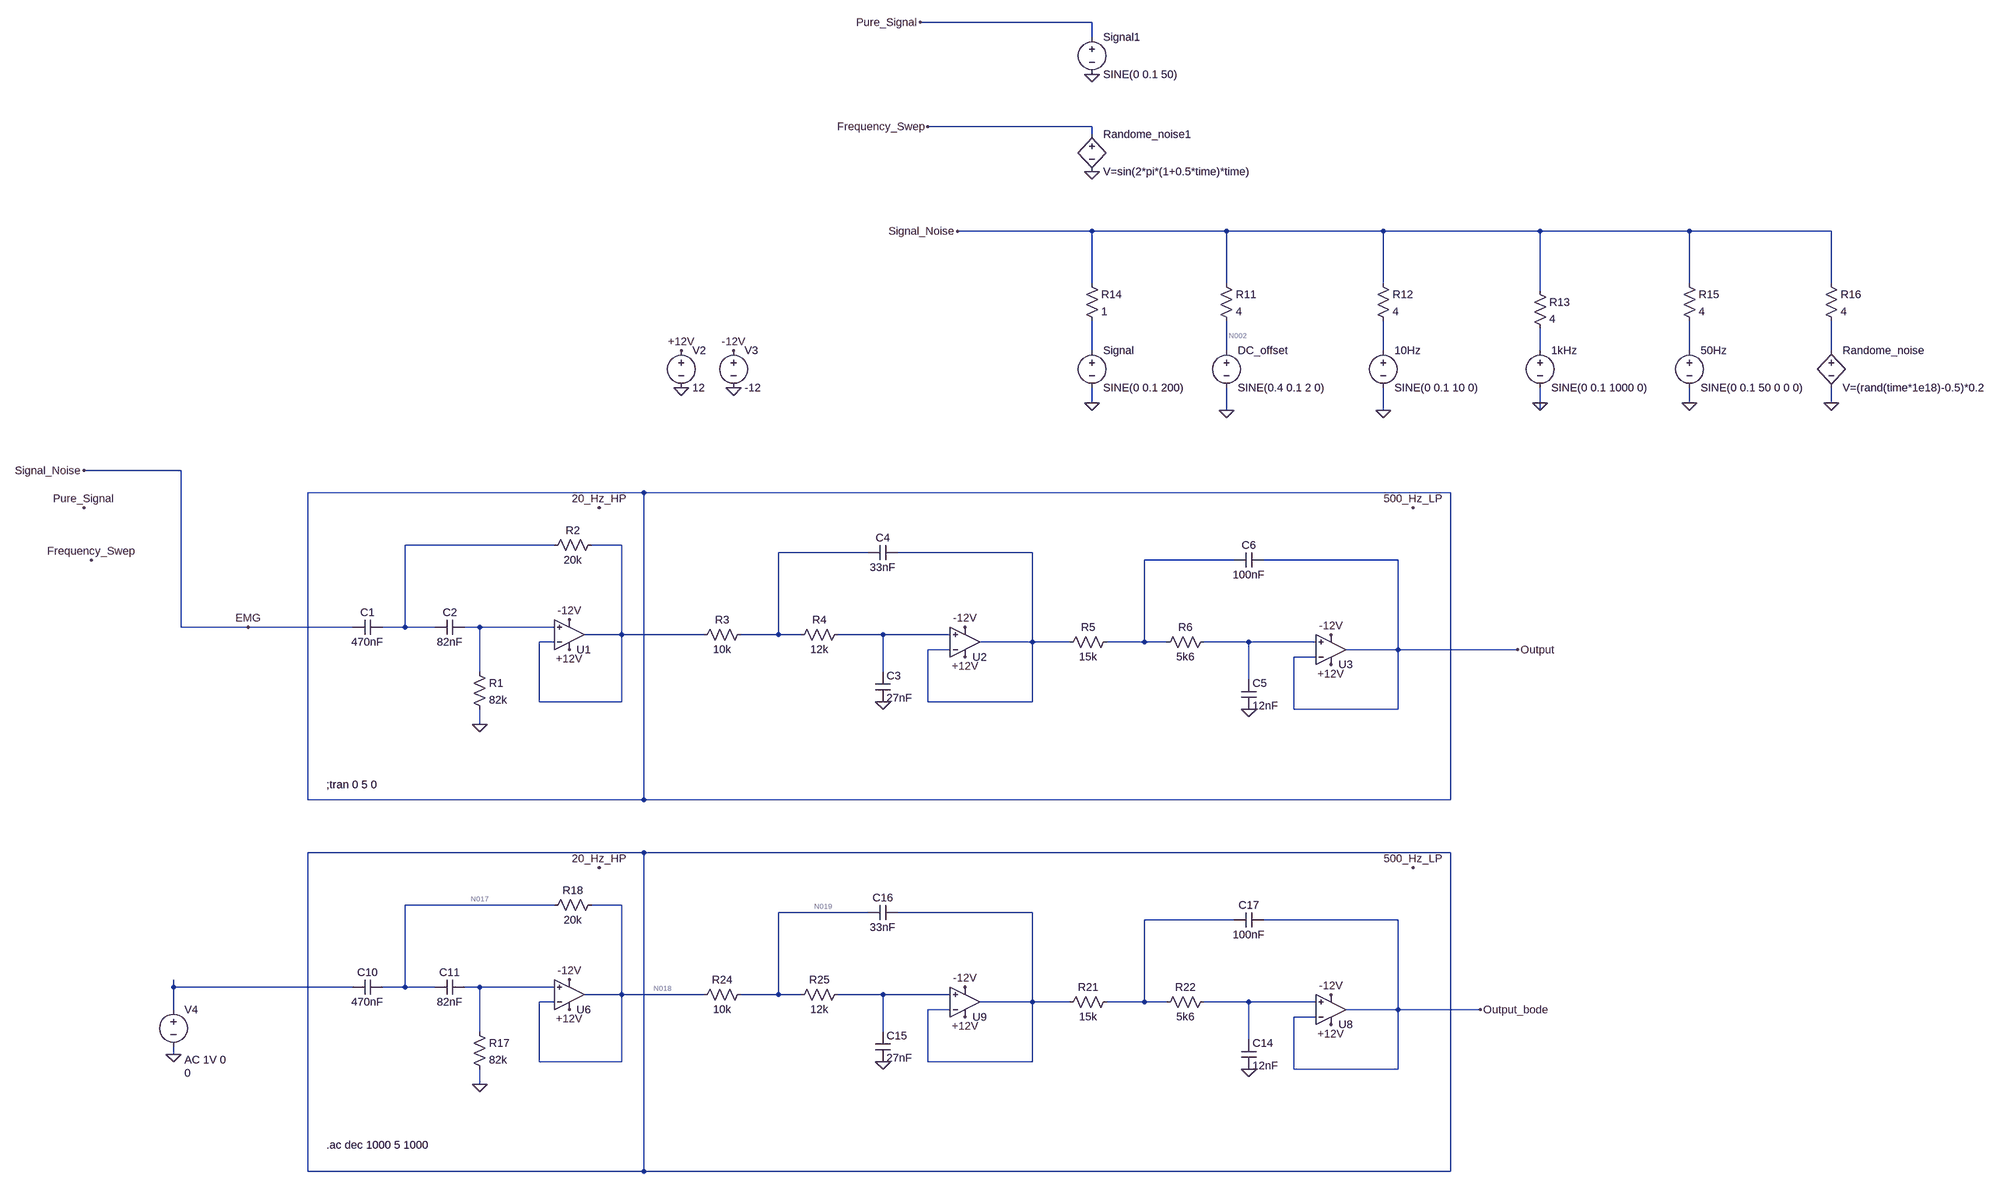
[diagram p0: schematic Analog_Filter_EMG.asc]
Analog_Filter_EMG.asc, the LTspice schematic file:
Version 4
SHEET 1 4328 1684
WIRE 1040 -1360 672 -1360
WIRE 1040 -1328 1040 -1360
WIRE 1040 -1136 688 -1136
WIRE 1040 -1120 1040 -1136
WIRE 1040 -912 752 -912
WIRE 1328 -912 1040 -912
WIRE 1664 -912 1328 -912
WIRE 2000 -912 1664 -912
WIRE 2320 -912 2000 -912
WIRE 2624 -912 2320 -912
WIRE 1040 -800 1040 -912
WIRE 1328 -800 1328 -912
WIRE 1664 -800 1664 -912
WIRE 2320 -800 2320 -912
WIRE 2624 -800 2624 -912
WIRE 2000 -784 2000 -912
WIRE 1040 -656 1040 -720
WIRE 1328 -656 1328 -720
WIRE 1664 -656 1664 -720
WIRE 2000 -656 2000 -704
WIRE 2320 -656 2320 -720
WIRE 2624 -656 2624 -720
WIRE 1040 -544 1040 -576
WIRE 2000 -544 2000 -576
WIRE 2320 -544 2320 -576
WIRE 2624 -544 2624 -576
WIRE 1328 -528 1328 -576
WIRE 1664 -528 1664 -576
WIRE 2000 -528 2000 -544
WIRE -912 -224 -1120 -224
WIRE 80 -176 -640 -176
WIRE 1808 -176 80 -176
WIRE -112 -64 -432 -64
WIRE 32 -64 -32 -64
WIRE 560 -48 368 -48
WIRE 912 -48 624 -48
WIRE 1344 -32 1152 -32
WIRE 1696 -32 1408 -32
WIRE -912 112 -912 -224
WIRE -768 112 -912 112
WIRE -544 112 -768 112
WIRE -432 112 -432 -64
WIRE -432 112 -480 112
WIRE -368 112 -432 112
WIRE -272 112 -304 112
WIRE -112 112 -272 112
WIRE 32 128 32 -64
WIRE 32 128 -48 128
WIRE 208 128 32 128
WIRE 368 128 368 -48
WIRE 368 128 288 128
WIRE 416 128 368 128
WIRE 592 128 496 128
WIRE 736 128 592 128
WIRE -112 144 -144 144
WIRE 912 144 912 -48
WIRE 912 144 800 144
WIRE 992 144 912 144
WIRE 1152 144 1152 -32
WIRE 1152 144 1072 144
WIRE 1200 144 1152 144
WIRE 1376 144 1280 144
WIRE 1520 144 1376 144
WIRE 736 160 688 160
WIRE 1696 160 1696 -32
WIRE 1696 160 1584 160
WIRE 1952 160 1696 160
WIRE 1520 176 1472 176
WIRE -272 208 -272 112
WIRE 592 208 592 128
WIRE 1376 224 1376 144
WIRE -144 272 -144 144
WIRE 32 272 32 128
WIRE 32 272 -144 272
WIRE 688 272 688 160
WIRE 912 272 912 144
WIRE 912 272 688 272
WIRE 1472 288 1472 176
WIRE 1696 288 1696 160
WIRE 1696 288 1472 288
WIRE -272 320 -272 288
WIRE -640 640 -640 -176
WIRE 80 640 80 -176
WIRE 80 640 -640 640
WIRE 1808 640 1808 -176
WIRE 1808 640 80 640
WIRE 80 784 -640 784
WIRE 1808 784 80 784
WIRE -112 896 -432 896
WIRE 32 896 -32 896
WIRE 560 912 368 912
WIRE 912 912 624 912
WIRE 1344 928 1152 928
WIRE 1696 928 1408 928
WIRE -928 1072 -928 1056
WIRE -544 1072 -928 1072
WIRE -432 1072 -432 896
WIRE -432 1072 -480 1072
WIRE -368 1072 -432 1072
WIRE -272 1072 -304 1072
WIRE -112 1072 -272 1072
WIRE 32 1088 32 896
WIRE 32 1088 -48 1088
WIRE 208 1088 32 1088
WIRE 368 1088 368 912
WIRE 368 1088 288 1088
WIRE 416 1088 368 1088
WIRE 592 1088 496 1088
WIRE 736 1088 592 1088
WIRE -112 1104 -144 1104
WIRE 912 1104 912 912
WIRE 912 1104 800 1104
WIRE 992 1104 912 1104
WIRE 1152 1104 1152 928
WIRE 1152 1104 1072 1104
WIRE 1200 1104 1152 1104
WIRE 1376 1104 1280 1104
WIRE 1520 1104 1376 1104
WIRE -928 1120 -928 1072
WIRE 736 1120 688 1120
WIRE 1696 1120 1696 928
WIRE 1696 1120 1584 1120
WIRE 1872 1120 1696 1120
WIRE 1520 1136 1472 1136
WIRE -272 1168 -272 1072
WIRE 592 1168 592 1088
WIRE 1376 1184 1376 1104
WIRE -928 1216 -928 1200
WIRE -144 1232 -144 1104
WIRE 32 1232 32 1088
WIRE 32 1232 -144 1232
WIRE 688 1232 688 1120
WIRE 912 1232 912 1104
WIRE 912 1232 688 1232
WIRE 1472 1248 1472 1136
WIRE 1696 1248 1696 1120
WIRE 1696 1248 1472 1248
WIRE -272 1280 -272 1248
WIRE -640 1600 -640 784
WIRE 80 1600 80 784
WIRE 80 1600 -640 1600
WIRE 1808 1600 1808 784
WIRE 1808 1600 80 1600
FLAG 272 -576 0
FLAG 160 -576 0
FLAG 160 -656 +12V
FLAG 272 -656 -12V
FLAG 1328 -528 0
FLAG 1664 -528 0
FLAG 2000 -544 0
FLAG 1040 -544 0
FLAG 752 -912 Signal_Noise
FLAG -1120 -224 Signal_Noise
FLAG 2320 -544 0
FLAG 2624 -544 0
FLAG 1952 160 Output
FLAG -272 1280 0
FLAG -80 1056 -12V
FLAG -80 1120 +12V
FLAG 592 1232 0
FLAG 768 1072 -12V
FLAG 768 1136 +12V
FLAG -16 816 20_Hz_HP
FLAG 1728 816 500_Hz_LP
FLAG 1872 1120 Output_bode
FLAG -928 1216 0
FLAG 1040 -1040 0
FLAG 688 -1136 Frequency_Swep
FLAG -1104 -32 Frequency_Swep
FLAG 1040 -1248 0
FLAG 672 -1360 Pure_Signal
FLAG -1120 -144 Pure_Signal
FLAG 1376 1248 0
FLAG 1552 1088 -12V
FLAG 1552 1152 +12V
FLAG -272 320 0
FLAG -80 96 -12V
FLAG -80 160 +12V
FLAG 592 272 0
FLAG 768 112 -12V
FLAG 768 176 +12V
FLAG -16 -144 20_Hz_HP
FLAG 1728 -144 500_Hz_LP
FLAG 1376 288 0
FLAG 1552 128 -12V
FLAG 1552 192 +12V
FLAG -768 112 EMG
SYMBOL voltage 1664 -672 R0
WINDOW 123 0 0 Left 0
WINDOW 39 0 0 Left 0
SYMATTR InstName 10Hz
SYMATTR Value SINE(0 0.1 10 0)
SYMBOL voltage 160 -672 R0
WINDOW 123 0 0 Left 0
WINDOW 39 0 0 Left 0
SYMATTR InstName V2
SYMATTR Value 12
SYMBOL voltage 272 -672 R0
WINDOW 123 0 0 Left 0
WINDOW 39 0 0 Left 0
SYMATTR InstName V3
SYMATTR Value -12
SYMBOL voltage 2000 -672 R0
WINDOW 123 0 0 Left 0
WINDOW 39 0 0 Left 0
SYMATTR InstName 1kHz
SYMATTR Value SINE(0 0.1 1000 0)
SYMBOL voltage 1328 -672 R0
WINDOW 123 0 0 Left 0
WINDOW 39 0 0 Left 0
SYMATTR InstName DC_offset
SYMATTR Value SINE(0.4 0.1 2 0)
SYMBOL res 1312 -816 R0
SYMATTR InstName R11
SYMATTR Value 4
SYMBOL res 1648 -816 R0
SYMATTR InstName R12
SYMATTR Value 4
SYMBOL res 1984 -800 R0
SYMATTR InstName R13
SYMATTR Value 4
SYMBOL voltage 1040 -672 R0
WINDOW 123 0 0 Left 0
WINDOW 39 0 0 Left 0
SYMATTR InstName Signal
SYMATTR Value SINE(0 0.1 200)
SYMBOL res 1024 -816 R0
SYMATTR InstName R14
SYMATTR Value 1
SYMBOL voltage 2320 -672 R0
WINDOW 123 0 0 Left 0
WINDOW 39 0 0 Left 0
SYMATTR InstName 50Hz
SYMATTR Value SINE(0 0.1 50 0 0 0)
SYMBOL res 2304 -816 R0
SYMATTR InstName R15
SYMATTR Value 4
SYMBOL bv 2624 -672 R0
SYMATTR InstName Randome_noise
SYMATTR Value V=(rand(time*1e18)-0.5)*0.2
SYMBOL res 2608 -816 R0
SYMATTR InstName R16
SYMATTR Value 4
SYMBOL cap -480 1056 R90
WINDOW 0 0 32 VBottom 2
WINDOW 3 32 32 VTop 2
SYMATTR InstName C10
SYMATTR Value 470nF
SYMBOL cap -304 1056 R90
WINDOW 0 0 32 VBottom 2
WINDOW 3 32 32 VTop 2
SYMATTR InstName C11
SYMATTR Value 82nF
SYMBOL res -288 1152 R0
SYMATTR InstName R17
SYMATTR Value 82k
SYMBOL res -16 880 R90
WINDOW 0 0 56 VBottom 2
WINDOW 3 32 56 VTop 2
SYMATTR InstName R18
SYMATTR Value 20k
SYMBOL Opamps\\UniversalOpamp2 -80 1088 M180
SYMATTR InstName U6
SYMBOL res 304 1072 R90
WINDOW 0 0 56 VBottom 2
WINDOW 3 32 56 VTop 2
SYMATTR InstName R24
SYMATTR Value 10k
SYMBOL res 512 1072 R90
WINDOW 0 0 56 VBottom 2
WINDOW 3 32 56 VTop 2
SYMATTR InstName R25
SYMATTR Value 12k
SYMBOL cap 576 1168 R0
SYMATTR InstName C15
SYMATTR Value 27nF
SYMBOL cap 624 896 R90
WINDOW 0 0 32 VBottom 2
WINDOW 3 32 32 VTop 2
SYMATTR InstName C16
SYMATTR Value 33nF
SYMBOL Opamps\\UniversalOpamp2 768 1104 M180
SYMATTR InstName U9
SYMBOL voltage -928 1104 R0
WINDOW 3 24 152 Left 2
WINDOW 123 24 124 Left 2
WINDOW 39 0 0 Left 0
SYMATTR Value 0
SYMATTR Value2 AC 1V 0
SYMATTR InstName V4
SYMBOL bv 1040 -1136 R0
SYMATTR InstName Randome_noise1
SYMATTR Value V=sin(2*pi*(1+0.5*time)*time)
SYMBOL voltage 1040 -1344 R0
WINDOW 123 0 0 Left 0
WINDOW 39 0 0 Left 0
SYMATTR InstName Signal1
SYMATTR Value SINE(0 0.1 50)
SYMBOL res 1088 1088 R90
WINDOW 0 0 56 VBottom 2
WINDOW 3 32 56 VTop 2
SYMATTR InstName R21
SYMATTR Value 15k
SYMBOL res 1296 1088 R90
WINDOW 0 0 56 VBottom 2
WINDOW 3 32 56 VTop 2
SYMATTR InstName R22
SYMATTR Value 5k6
SYMBOL cap 1360 1184 R0
SYMATTR InstName C14
SYMATTR Value 12nF
SYMBOL cap 1408 912 R90
WINDOW 0 0 32 VBottom 2
WINDOW 3 32 32 VTop 2
SYMATTR InstName C17
SYMATTR Value 100nF
SYMBOL Opamps\\UniversalOpamp2 1552 1120 M180
SYMATTR InstName U8
SYMBOL cap -480 96 R90
WINDOW 0 0 32 VBottom 2
WINDOW 3 32 32 VTop 2
SYMATTR InstName C1
SYMATTR Value 470nF
SYMBOL cap -304 96 R90
WINDOW 0 0 32 VBottom 2
WINDOW 3 32 32 VTop 2
SYMATTR InstName C2
SYMATTR Value 82nF
SYMBOL res -288 192 R0
SYMATTR InstName R1
SYMATTR Value 82k
SYMBOL res -16 -80 R90
WINDOW 0 0 56 VBottom 2
WINDOW 3 32 56 VTop 2
SYMATTR InstName R2
SYMATTR Value 20k
SYMBOL Opamps\\UniversalOpamp2 -80 128 M180
SYMATTR InstName U1
SYMBOL res 304 112 R90
WINDOW 0 0 56 VBottom 2
WINDOW 3 32 56 VTop 2
SYMATTR InstName R3
SYMATTR Value 10k
SYMBOL res 512 112 R90
WINDOW 0 0 56 VBottom 2
WINDOW 3 32 56 VTop 2
SYMATTR InstName R4
SYMATTR Value 12k
SYMBOL cap 576 208 R0
SYMATTR InstName C3
SYMATTR Value 27nF
SYMBOL cap 624 -64 R90
WINDOW 0 0 32 VBottom 2
WINDOW 3 32 32 VTop 2
SYMATTR InstName C4
SYMATTR Value 33nF
SYMBOL Opamps\\UniversalOpamp2 768 144 M180
SYMATTR InstName U2
SYMBOL res 1088 128 R90
WINDOW 0 0 56 VBottom 2
WINDOW 3 32 56 VTop 2
SYMATTR InstName R5
SYMATTR Value 15k
SYMBOL res 1296 128 R90
WINDOW 0 0 56 VBottom 2
WINDOW 3 32 56 VTop 2
SYMATTR InstName R6
SYMATTR Value 5k6
SYMBOL cap 1360 224 R0
SYMATTR InstName C5
SYMATTR Value 12nF
SYMBOL cap 1408 -48 R90
WINDOW 0 0 32 VBottom 2
WINDOW 3 32 32 VTop 2
SYMATTR InstName C6
SYMATTR Value 100nF
SYMBOL Opamps\\UniversalOpamp2 1552 160 M180
SYMATTR InstName U3
TEXT -600 1544 Left 2 !.ac dec 1000 5 1000
TEXT -600 608 Left 2 !;tran 0 5 0

The netlist it stands for:
* Analog_Filter_EMG.asc
V§10Hz N003 0 SINE(0 0.1 10 0)
V2 +12V 0 12
V3 -12V 0 -12
V§1kHz N004 0 SINE(0 0.1 1000 0)
V§DC_offset N002 0 SINE(0.4 0.1 2 0)
R11 EMG N002 4
R12 EMG N003 4
R13 EMG N004 4
V§Signal N001 0 SINE(0 0.1 200)
R14 EMG N001 1
V§50Hz N005 0 SINE(0 0.1 50 0 0 0)
R15 EMG N005 4
B§Randome_noise N006 0 V=(rand(time*1e18)-0.5)*0.2
R16 EMG N006 4
C10 N017 N022 470nF
C11 N023 N017 82nF
R17 N023 0 82k
R18 N018 N017 20k
XU6 N023 N018 +12V -12V N018 level.2 Avol=1Meg GBW=10Meg Slew=10Meg ilimit=25m rail=0 Vos=0 phimargin=45 en=0 enk=0 in=0 ink=0 Rin=500Meg  ; pins IN+ IN- V+ V- OUT
R24 N019 N018 10k
R25 N024 N019 12k
C15 N024 0 27nF
C16 N020 N019 33nF
XU9 N024 N020 +12V -12V N020 level.2 Avol=1Meg GBW=10Meg Slew=10Meg ilimit=25m rail=0 Vos=0 phimargin=45 en=0 enk=0 in=0 ink=0 Rin=500Meg  ; pins IN+ IN- V+ V- OUT
V4 N022 0 0 AC 1V 0
B§Randome_noise1 Frequency_Swep 0 V=sin(2*pi*(1+0.5*time)*time)
V§Signal1 Pure_Signal 0 SINE(0 0.1 50)
R21 N021 N020 15k
R22 N025 N021 5k6
C14 N025 0 12nF
C17 Output_bode N021 100nF
XU8 N025 Output_bode +12V -12V Output_bode level.2 Avol=1Meg GBW=10Meg Slew=10Meg ilimit=25m rail=0 Vos=0 phimargin=45 en=0 enk=0 in=0 ink=0 Rin=500Meg  ; pins IN+ IN- V+ V- OUT
C1 N008 EMG 470nF
C2 N013 N008 82nF
R1 N013 0 82k
R2 N009 N008 20k
XU1 N013 N009 +12V -12V N009 level.2 Avol=1Meg GBW=10Meg Slew=10Meg ilimit=25m rail=0 Vos=0 phimargin=45 en=0 enk=0 in=0 ink=0 Rin=500Meg  ; pins IN+ IN- V+ V- OUT
R3 N010 N009 10k
R4 N014 N010 12k
C3 N014 0 27nF
C4 N011 N010 33nF
XU2 N014 N011 +12V -12V N011 level.2 Avol=1Meg GBW=10Meg Slew=10Meg ilimit=25m rail=0 Vos=0 phimargin=45 en=0 enk=0 in=0 ink=0 Rin=500Meg  ; pins IN+ IN- V+ V- OUT
R5 N012 N011 15k
R6 N015 N012 5k6
C5 N015 0 12nF
C6 Output N012 100nF
XU3 N015 Output +12V -12V Output level.2 Avol=1Meg GBW=10Meg Slew=10Meg ilimit=25m rail=0 Vos=0 phimargin=45 en=0 enk=0 in=0 ink=0 Rin=500Meg  ; pins IN+ IN- V+ V- OUT
.ac dec 1000 5 1000
;tran 0 5 0
.lib UniversalOpamps2.sub
.backanno
.end

* Results of the author's LTspice run, read from the files saved beside the schematic
* Operating Point, zero values left out:
*   V(+12v) = 12 V
*   V(-12v) = -12 V
*   V(n002) = 400 mV
*   V(emg) = 44.44 mV
*   I(Randome_noise) = 11.11 mA
*   I(R16) = 11.11 mA
*   I(R15) = 11.11 mA
*   I(R14) = 44.44 mA
*   I(R13) = 11.11 mA
*   I(R12) = 11.11 mA
*   I(R11) = -88.89 mA
*   I(50hz) = 11.11 mA
*   I(Signal) = 44.44 mA
*   I(Dc_offset) = -88.89 mA
*   I(1khz) = 11.11 mA
*   I(V3) = 7.195 mA
*   I(V2) = -7.195 mA
*   I(10hz) = 11.11 mA
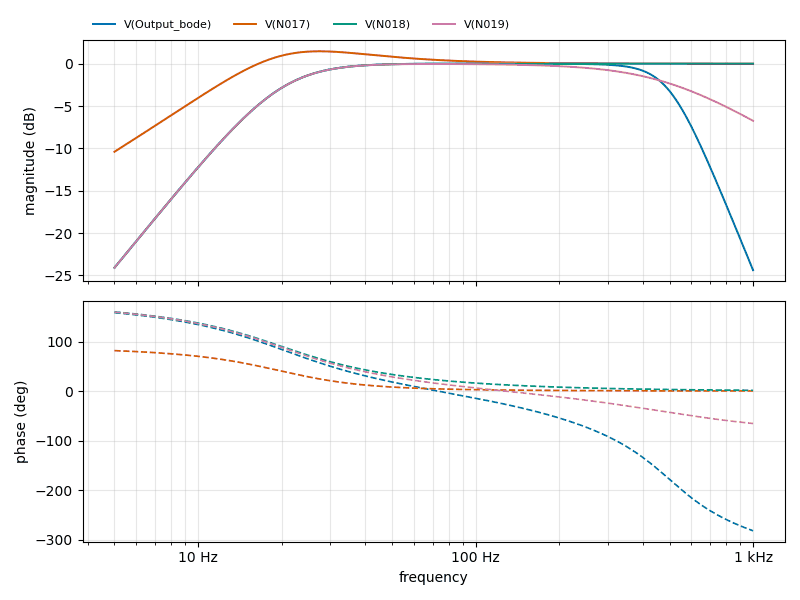
[diagram p1: AC Analysis of Analog_Filter_EMG.asc, plotted from the saved traces]
* AC Analysis, 1 run:
*   V(Output_bode): -24.10 dB at 5 Hz, -24.39 dB at 1 kHz, peak 0.01 dB at 104.7 Hz, 3 dB below the peak at 19.68 Hz and 493.5 Hz
*   V(N017): -10.40 dB at 5 Hz, 0.00 dB at 1 kHz, peak 1.46 dB at 27.35 Hz, 3 dB below the peak at 13.32 Hz
*   V(N018): -24.10 dB at 5 Hz, 0.00 dB at 1 kHz, peak 0.01 dB at 105.9 Hz, 3 dB below the peak at 19.68 Hz
*   V(N019): -24.10 dB at 5 Hz, -6.74 dB at 1 kHz, peak -0.03 dB at 70.63 Hz, 3 dB below the peak at 19.6 Hz and 576.5 Hz